# Altium schematic sheet DM3390_Connector_C.SchDoc: =project_title
size Tabloid; CompanyName: Luxonis Holding; Organization: Luxonis Holding; Address1: 1925 Harmony Park Drive; Address2: Westminster, CO; Address3: 80234; Address4: United States; SheetNumber: 9; SheetTotal: 12
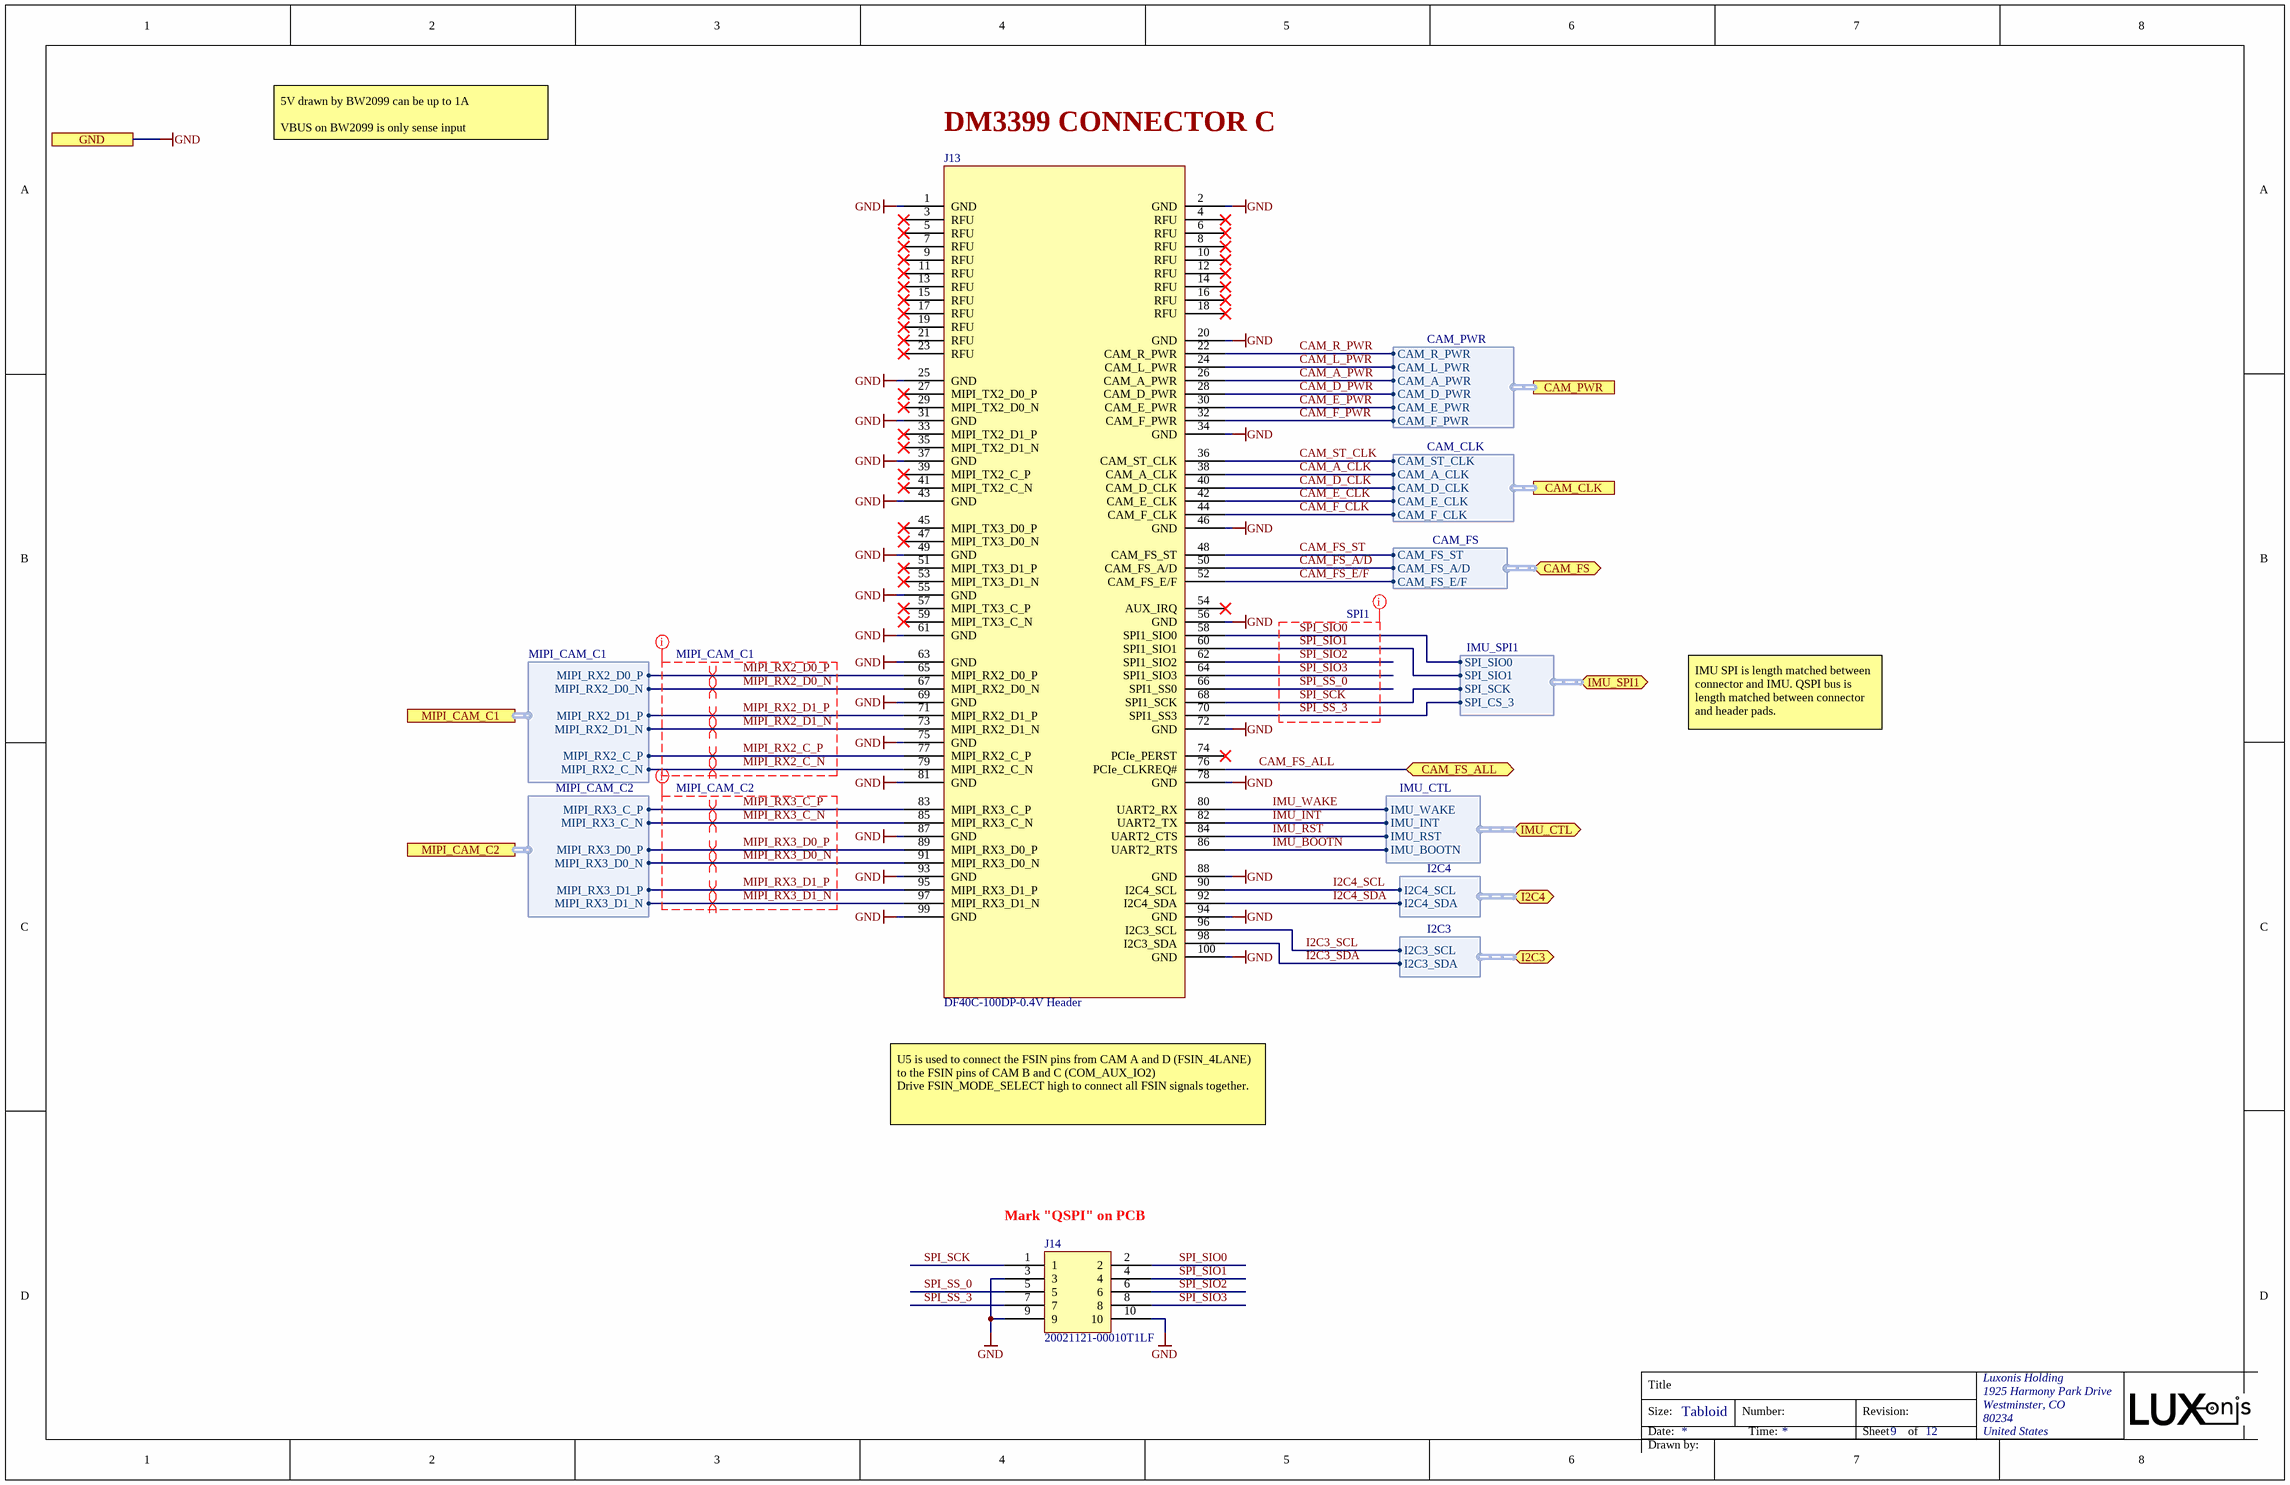
[diagram p0: DM3390_Connector_C.SchDoc]

## Parts
J13  DF40C-100DP-0.4V Header  [CON_C_SoM-MAX_DF40HC-3.0-100DS-0.4V_minpad]
J14  20021121-00010T1LF  [20021121-00010T1LF]

## Ports
CAM_CLK (harness CAM_CLK), CAM_FS (bidir, harness CAM_FS), CAM_FS_ALL (bidir), CAM_PWR (harness CAM_PWR), GND, I2C3 (bidir, harness I2C3), I2C4 (bidir, harness I2C4), IMU_CTL (bidir, harness IMU_CTL), IMU_SPI1 (bidir, harness IMU_SPI1), MIPI_CAM_C1 (harness MIPI_CAM_C1), MIPI_CAM_C2 (harness MIPI_CAM_C2)

## Harnesses
MIPI_CAM_C1: MIPI_RX2_D0_P, MIPI_RX2_D0_N, MIPI_RX2_D1_P, MIPI_RX2_D1_N, MIPI_RX2_C_P, MIPI_RX2_C_N
MIPI_CAM_C2: MIPI_RX3_C_P, MIPI_RX3_C_N, MIPI_RX3_D0_N, MIPI_RX3_D0_P, MIPI_RX3_D1_P, MIPI_RX3_D1_N
I2C3: I2C3_SCL, I2C3_SDA
I2C4: I2C4_SCL, I2C4_SDA
IMU_SPI1: SPI_SIO0, SPI_SIO1, SPI_CS_3, SPI_SCK
CAM_PWR: CAM_R_PWR, CAM_L_PWR, CAM_A_PWR, CAM_D_PWR, CAM_E_PWR, CAM_F_PWR
CAM_CLK: CAM_ST_CLK, CAM_A_CLK, CAM_D_CLK, CAM_E_CLK, CAM_F_CLK
CAM_FS: CAM_FS_ST, CAM_FS_A/D, CAM_FS_E/F
IMU_CTL: IMU_WAKE, IMU_INT, IMU_RST, IMU_BOOTN

## Nets
GND: J13.1(GND) J13.2(GND) J13.20(GND) J13.25(GND) J13.31(GND) J13.34(GND) J13.37(GND) J13.43(GND) J13.46(GND) J13.49(GND) J13.55(GND) J13.56(GND) J13.61(GND) J13.63(GND) J13.69(GND) J13.72(GND) J13.75(GND) J13.78(GND) J13.81(GND) J13.87(GND) J13.88(GND) J13.93(GND) J13.94(GND) J13.99(GND) J13.100(GND) J14.3 J14.9 J14.10 ; port GND
CAM_A_CLK: J13.38(CAM_A_CLK) ; port CAM_CLK.CAM_A_CLK
CAM_A_PWR: J13.26(CAM_A_PWR) ; port CAM_PWR.CAM_A_PWR
CAM_D_CLK: J13.40(CAM_D_CLK) ; port CAM_CLK.CAM_D_CLK
CAM_D_PWR: J13.28(CAM_D_PWR) ; port CAM_PWR.CAM_D_PWR
CAM_E_CLK: J13.42(CAM_E_CLK) ; port CAM_CLK.CAM_E_CLK
CAM_E_PWR: J13.30(CAM_E_PWR) ; port CAM_PWR.CAM_E_PWR
CAM_F_CLK: J13.44(CAM_F_CLK) ; port CAM_CLK.CAM_F_CLK
CAM_F_PWR: J13.32(CAM_F_PWR) ; port CAM_PWR.CAM_F_PWR
CAM_FS_A/D: J13.50(CAM_FS_A/D) ; port CAM_FS.CAM_FS_A/D
CAM_FS_ALL: J13.76(PCIe_CLKREQ#) ; port CAM_FS_ALL
CAM_FS_E/F: J13.52(CAM_FS_E/F) ; port CAM_FS.CAM_FS_E/F
CAM_FS_ST: J13.48(CAM_FS_ST) ; port CAM_FS.CAM_FS_ST
CAM_L_PWR: J13.24(CAM_L_PWR) ; port CAM_PWR.CAM_L_PWR
CAM_R_PWR: J13.22(CAM_R_PWR) ; port CAM_PWR.CAM_R_PWR
CAM_ST_CLK: J13.36(CAM_ST_CLK) ; port CAM_CLK.CAM_ST_CLK
I2C3_SCL: J13.96(I2C3_SCL) ; port I2C3.I2C3_SCL
I2C3_SDA: J13.98(I2C3_SDA) ; port I2C3.I2C3_SDA
I2C4_SCL: J13.90(I2C4_SCL) ; port I2C4.I2C4_SCL
I2C4_SDA: J13.92(I2C4_SDA) ; port I2C4.I2C4_SDA
IMU_BOOTN: J13.86(UART2_RTS) ; port IMU_CTL.IMU_BOOTN
IMU_INT: J13.82(UART2_TX) ; port IMU_CTL.IMU_INT
IMU_RST: J13.84(UART2_CTS) ; port IMU_CTL.IMU_RST
IMU_WAKE: J13.80(UART2_RX) ; port IMU_CTL.IMU_WAKE
MIPI_RX2_C_N: J13.79(MIPI_RX2_C_N) ; port MIPI_CAM_C1.MIPI_RX2_C_N
MIPI_RX2_C_P: J13.77(MIPI_RX2_C_P) ; port MIPI_CAM_C1.MIPI_RX2_C_P
MIPI_RX2_D0_N: J13.67(MIPI_RX2_D0_N) ; port MIPI_CAM_C1.MIPI_RX2_D0_N
MIPI_RX2_D0_P: J13.65(MIPI_RX2_D0_P) ; port MIPI_CAM_C1.MIPI_RX2_D0_P
MIPI_RX2_D1_N: J13.73(MIPI_RX2_D1_N) ; port MIPI_CAM_C1.MIPI_RX2_D1_N
MIPI_RX2_D1_P: J13.71(MIPI_RX2_D1_P) ; port MIPI_CAM_C1.MIPI_RX2_D1_P
MIPI_RX3_C_N: J13.85(MIPI_RX3_C_N) ; port MIPI_CAM_C2.MIPI_RX3_C_N
MIPI_RX3_C_P: J13.83(MIPI_RX3_C_P) ; port MIPI_CAM_C2.MIPI_RX3_C_P
MIPI_RX3_D0_N: J13.91(MIPI_RX3_D0_N) ; port MIPI_CAM_C2.MIPI_RX3_D0_N
MIPI_RX3_D0_P: J13.89(MIPI_RX3_D0_P) ; port MIPI_CAM_C2.MIPI_RX3_D0_P
MIPI_RX3_D1_N: J13.97(MIPI_RX3_D1_N) ; port MIPI_CAM_C2.MIPI_RX3_D1_N
MIPI_RX3_D1_P: J13.95(MIPI_RX3_D1_P) ; port MIPI_CAM_C2.MIPI_RX3_D1_P
SPI_SCK: J13.68(SPI1_SCK) J14.1 ; port IMU_SPI1.SPI_SCK
SPI_SIO0: J13.58(SPI1_SIO0) J14.2 ; port IMU_SPI1.SPI_SIO0
SPI_SIO1: J13.60(SPI1_SIO1) J14.4 ; port IMU_SPI1.SPI_SIO1
SPI_SIO2: J13.62(SPI1_SIO2) J14.6
SPI_SIO3: J13.64(SPI1_SIO3) J14.8
SPI_SS_0: J13.66(SPI1_SS0) J14.5
SPI_SS_3: J13.70(SPI1_SS3) J14.7 ; port IMU_SPI1.SPI_CS_3

Not connected (* = marked no-connect by the designer): J13 3(RFU)* 4(RFU)* 5(RFU)* 6(RFU)* 7(RFU)* 8(RFU)* 9(RFU)* 10(RFU)* 11(RFU)* 12(RFU)* 13(RFU)* 14(RFU)* 15(RFU)* 16(RFU)* 17(RFU)* 18(RFU)* 19(RFU)* 21(RFU)* 23(RFU)* 27(MIPI_TX2_D0_P)* 29(MIPI_TX2_D0_N)* 33(MIPI_TX2_D1_P)* 35(MIPI_TX2_D1_N)* 39(MIPI_TX2_C_P)* 41(MIPI_TX2_C_N)* 45(MIPI_TX3_D0_P)* 47(MIPI_TX3_D0_N)* 51(MIPI_TX3_D1_P)* 53(MIPI_TX3_D1_N)* 54(AUX_IRQ)* 57(MIPI_TX3_C_P)* 59(MIPI_TX3_C_N)* 74(PCIe_PERST)*

## Layout directives
differential pair; differential pair class 100ohm: MIPI_RX2_C_N, MIPI_RX2_C_P, MIPI_RX2_D0_N, MIPI_RX2_D0_P, MIPI_RX2_D1_N, MIPI_RX2_D1_P, MIPI_RX3_C_N, MIPI_RX3_C_P, MIPI_RX3_D0_N, MIPI_RX3_D0_P, MIPI_RX3_D1_N, MIPI_RX3_D1_P
net class MIPI_CAM_C1; rule Matched Net Lengths [Delay Tolerance = 1ps]; rule Matched Net Lengths [Delay Tolerance = 0,5ps]: MIPI_RX2_C_N, MIPI_RX2_C_P, MIPI_RX2_D0_N, MIPI_RX2_D0_P, MIPI_RX2_D1_N, MIPI_RX2_D1_P
net class MIPI_CAM_C2; rule Matched Net Lengths [Delay Tolerance = 1ps]; rule Matched Net Lengths [Delay Tolerance = 0,5ps]: MIPI_RX3_C_N, MIPI_RX3_C_P, MIPI_RX3_D0_N, MIPI_RX3_D0_P, MIPI_RX3_D1_N, MIPI_RX3_D1_P
net class SPI1: SPI_SCK, SPI_SIO0, SPI_SIO1, SPI_SIO2, SPI_SIO3, SPI_SS_0, SPI_SS_3

## Notes on the sheet
- 5V drawn by BW2099 can be up to 1A
  VBUS on BW2099 is only sense input
- DM3399 CONNECTOR C
- IMU SPI is length matched between connector and IMU. QSPI bus is length matched between connector and header pads.
- U5 is used to connect the FSIN pins from CAM A and D (FSIN_4LANE) to the FSIN pins of CAM B and C (COM_AUX_IO2)
  Drive FSIN_MODE_SELECT high to connect all FSIN signals together.
- (near J14) Mark "QSPI" on PCB
- Title
- Size:
- Date:
- Tabloid
- Number:
- Time:
- Revision:
- Sheet
- of
- Drawn by:

## Library data of the parts
J13 = DF40HC(3.0)-100DS-0.4V_OAK-SoM-MAX_C: CONN HDR 100POS 0.4MM SMD GOLD BW2099 SYMBOL; Manufacturer Part Number 1: DF40C-100DP-0.4V(51); mfg: Hirose; mated_height: 1.5mm; pin_current: 0.3A; Number of Contacts: 100; Voltage Rating: 30V; Current Rating: 300mA; Connector Type: Plug; Contact Resistance: 90mR; Gender: Male; Mated Stacking Heights: 4mm; pin_pitch: 0.4mm; mating_connector: DF40C-100DP-0.4V; mfg_pn: DF40C-100DP-0.4V; Supplier 1: Digi-Key; Manufacturer 1: Hirose; Stock 1: 10165; Pricing 1: 1=1.66000, 10=1.50900, 25=1.41680, 50=1.35520, 100=1.29360, 250=1.17040, 500=1.07800, 1000=0.92400 (USD); RoHS: Yes; Mount: Surface Mount; Contact Plating: Gold; Contact Material: Bronze; Housing Color: Black; Housing Material: Polymer; Min Operating Temperature: -35°C; Max Operating Temperature: 85°C; Number of Rows: 2; Termination: SMD/SMT; Package Quantity: 1; Packaging: Tape and Reel; Number of Positions: 100; Orientation: Straight; Max Current Rating: 300mA; Max Voltage Rating (AC): 30V; Length: 21.52mm; Pitch: 0.4mm; Depth: 1.85mm; Stack Height: 1.5mm; Radiation Hardening: No; REACH SVHC: Unknown; Lead Free: Lead Free; ComponentLink1URL: https://datasheet.ciiva.com/26948/getdatasheetpartid-434445-26948932.pdf?src-supplier=Verical; ComponentLink1Description: https://datasheet.ciiva.com/26948/getdatasheetpartid-434445-26948932.pdf?src-supplier=Verical; ComponentLink2URL: https://datasheet.ciiva.com/46408/1824826-46408893.pdf?src-supplier=Element14; ComponentLink2Description: https://datasheet.ciiva.com/46408/1824826-46408893.pdf?src-supplier=Element14; ComponentLink3URL: http://datasheet.octopart.com/DF40C-100DP-0.4V%2851%29-Hirose-datasheet-12512482.pdf?src-supplier=Newark; ComponentLink3Description: http://datasheet.octopart.com/DF40C-100DP-0.4V%2851%29-Hirose-datasheet-12512482.pdf?src-supplier=Newark; ComponentLink4URL: http://datasheet.octopart.com/DF40C-100DP-0.4V%2851%29-Hirose-datasheet-24967586.pdf?src-supplier=Element14; ComponentLink4Description: http://datasheet.octopart.com/DF40C-100DP-0.4V%2851%29-Hirose-datasheet-24967586.pdf?src-supplier=Element14; ComponentLink5URL: http://datasheet.octopart.com/DF40C-100DP-0.4V%2851%29-Hirose-datasheet-8329537.pdf?src-supplier=Factory+Futures; ComponentLink5Description: http://datasheet.octopart.com/DF40C-100DP-0.4V%2851%29-Hirose-datasheet-8329537.pdf?src-supplier=Factory+Futures; ComponentLink6URL: http://datasheet.octopart.com/DF40C-100DP-0.4V%2851%29-Hirose-datasheet-62290554.pdf?src-supplier=Future+Electronics; ComponentLink6Description: http://datasheet.octopart.com/DF40C-100DP-0.4V%2851%29-Hirose-datasheet-62290554.pdf?src-supplier=Future+Electronics; ComponentLink7URL: http://datasheet.octopart.com/DF40C-100DP-0.4V%2851%29-Hirose-datasheet-130255728.pdf?src-supplier=Future+Electronics; ComponentLink7Description: http://datasheet.octopart.com/DF40C-100DP-0.4V%2851%29-Hirose-datasheet-130255728.pdf?src-supplier=Future+Electronics; Supplier Part Number 1: H11614CT-ND; Supplier 2: Mouser; Supplier Part Number 2: 798-DF40C100DP0.4V51
J14 = 20021121-00010T1LF: CONN HEADER SMD 10POS 1.27MM; Manufacturer 1: Amphenol FCI; Number of Contacts: 10; Contact Resistance: 30mR; Max Voltage Rating (AC): 125V; Connector Type: Male Pin; Row Spacing: 0.05inch; Supplier 1: Digi-Key; Manufacturer Part Number 1: 20021121-00010T1LF; Stock 1: 1465; Pricing 1: 1=0.77000, 10=0.71800, 100=0.55040, 500=0.47860, 1000=0.39485, 5000=0.34699, 10000=0.32306 (USD); RoHS: Yes; Mount: Surface Mount; Contact Plating: Gold; Color: Black; Contact Material: Copper Alloy; Housing Color: Black; Housing Material: Thermoplastic; Min Operating Temperature: -40°C; Max Operating Temperature: 85°C; Number of Rows: 2; Termination: Solder; Package Quantity: 93; Packaging: Rail/Tube; Number of Positions: 10; Orientation: Straight; Length: 6.35mm; Pitch: 1.27mm; Contact Mating Length: 0.12inch; Depth: 3.4mm; ComponentLink1URL: https://datasheet.ciiva.com/18659/20021121-18659066.pdf?src-supplier=Digi-Key; ComponentLink1Description: https://datasheet.ciiva.com/18659/20021121-18659066.pdf?src-supplier=Digi-Key; ComponentLink2URL: https://datasheet.ciiva.com/10033/20021121-10033582.pdf?src-supplier=Avnet; ComponentLink2Description: https://datasheet.ciiva.com/10033/20021121-10033582.pdf?src-supplier=Avnet; Supplier Part Number 1: 609-6529-ND; Supplier 2: Mouser; Supplier 3: TTI; Supplier Part Number 2: 649-200211210010T1LF; Supplier Part Number 3: 20021121-00010T1LF